# EAGLE design Proto_shield_REV3-chris (EAGLE 7.1.0)
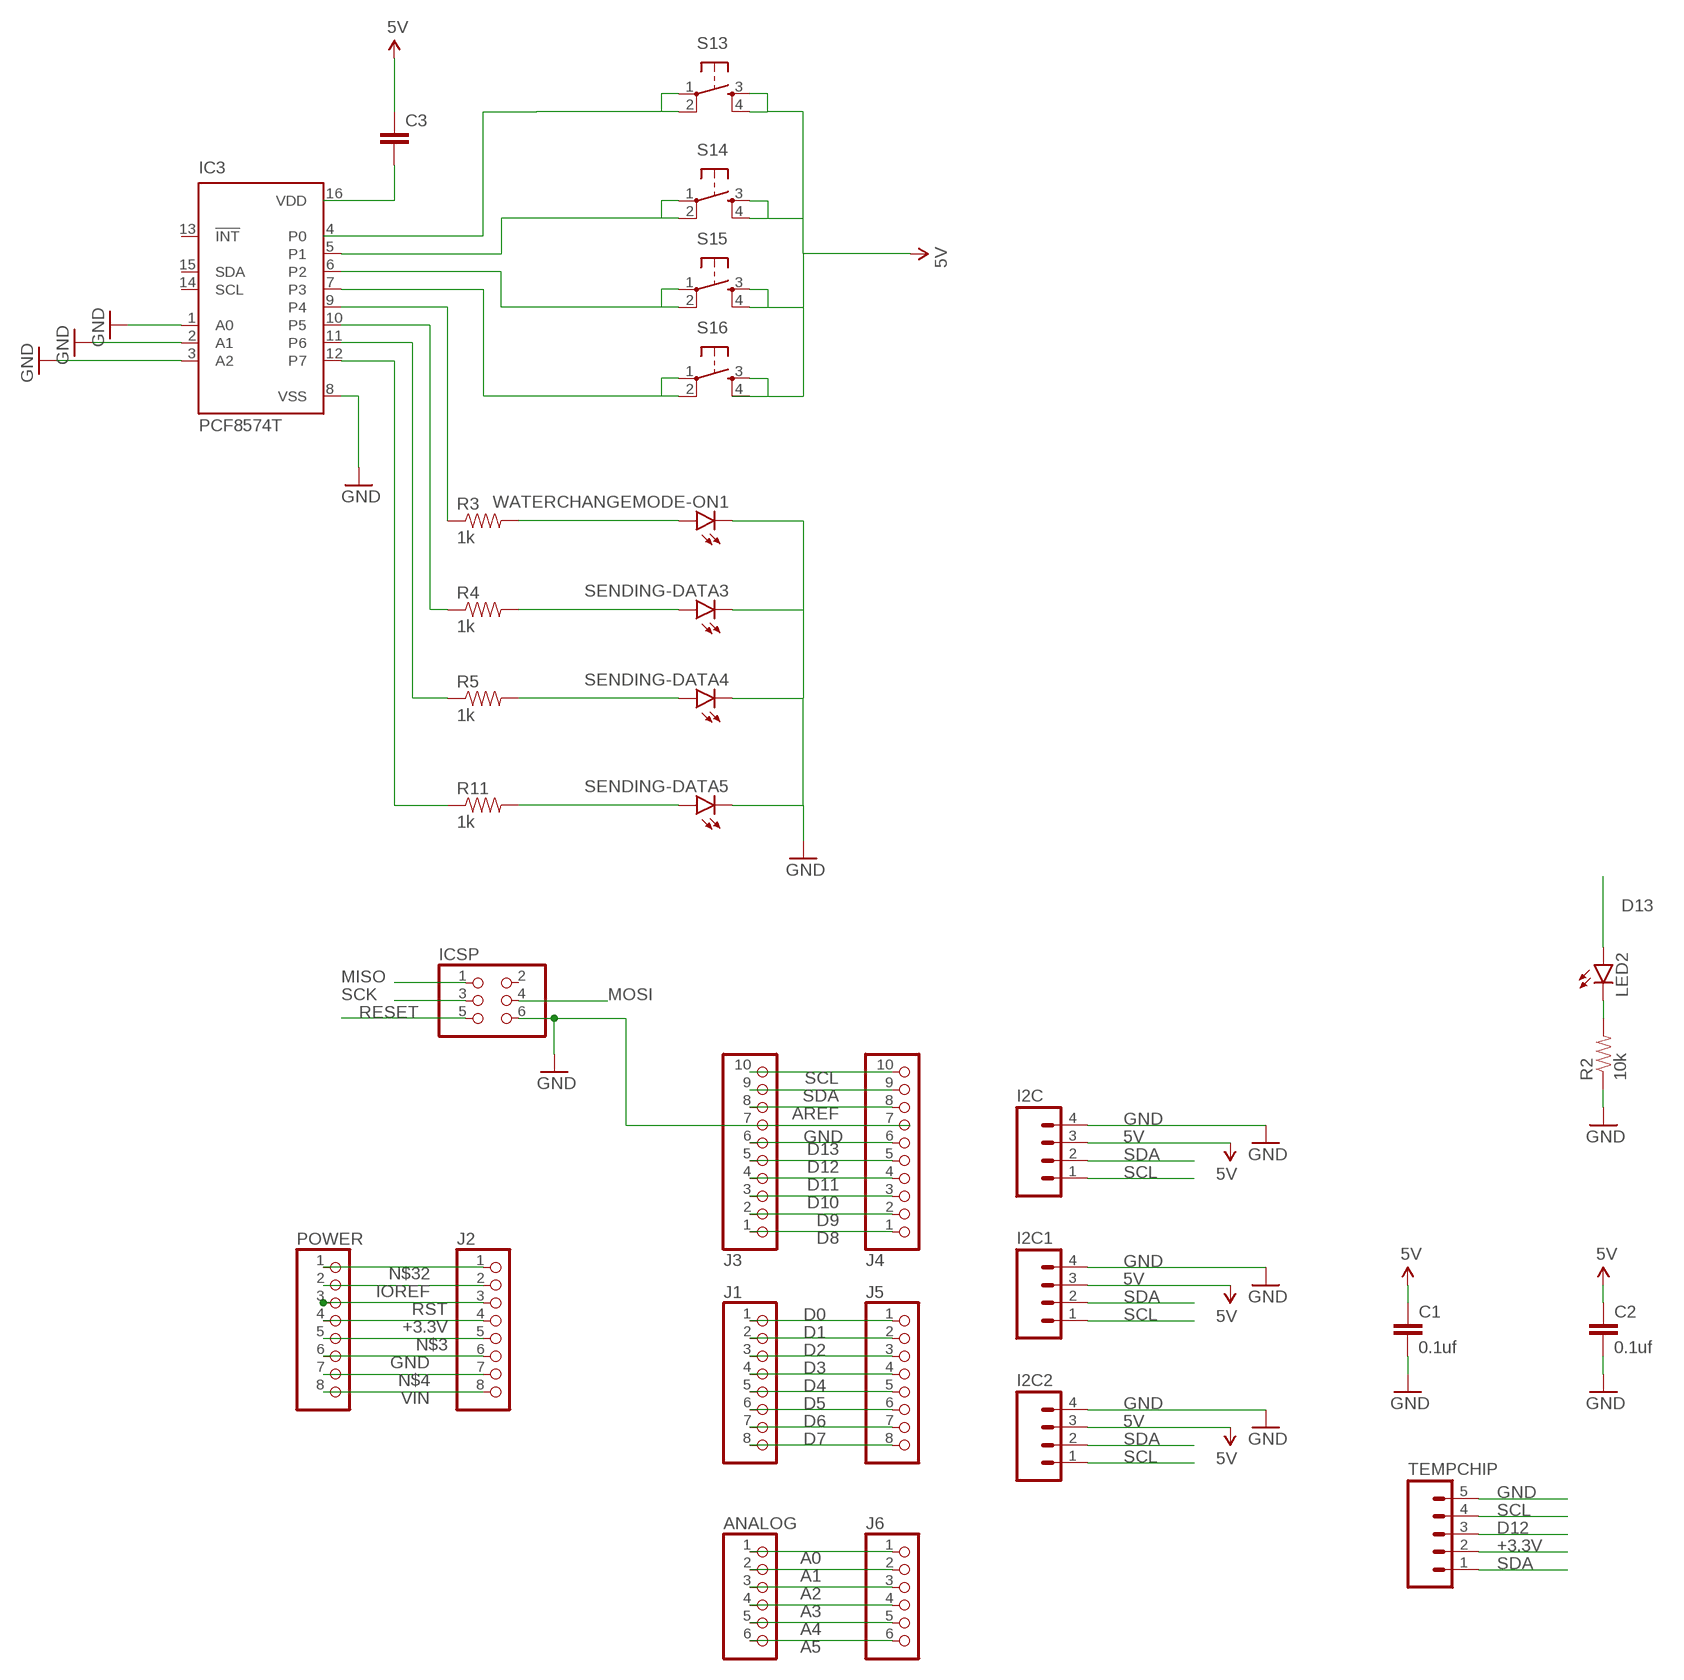
[diagram p0: schematic, sheet 1]

## Parts
ANALOG  PINHD-1X6  [1X06]
C1  0.1uf  CAPPTH2  [CAP-PTH-SMALL2]
C2  0.1uf  CAPPTH2  [CAP-PTH-SMALL2]
C3  CAPPTH2  [CAP-PTH-SMALL2]
I2C  M04PTH  [1X04]
I2C1  M04PTH  [1X04]
I2C2  M04PTH  [1X04]
IC3  PCF8574T  [SO16W]
ICSP  PINHD-2X3  [2X03]
J1  PINHD-1X8TH  [1X08-TH]
J2  PINHD-1X8TH  [1X08-TH]
J3  PINHD-1X10TH  [1X10-TH]
J4  PINHD-1X10TH  [1X10-TH]
J5  PINHD-1X8TH  [1X08-TH]
J6  PINHD-1X6  [1X06]
LED2  LED5MM  [LED5MM]
POWER  PINHD-1X8TH  [1X08-TH]
R2  10k  RESISTORAXIAL-0.3  [AXIAL-0.3]
R3  1k  RESISTORAXIAL-0.3  [AXIAL-0.3]
R4  1k  RESISTORAXIAL-0.3  [AXIAL-0.3]
R5  1k  RESISTORAXIAL-0.3  [AXIAL-0.3]
R11  1k  RESISTORAXIAL-0.3  [AXIAL-0.3]
S13  TAC_SWITCHPTH  [TACTILE-PTH]
S14  TAC_SWITCHPTH  [TACTILE-PTH]
S15  TAC_SWITCHPTH  [TACTILE-PTH]
S16  TAC_SWITCHPTH  [TACTILE-PTH]
SENDING-DATA3  LED3MM  [LED3MM]
SENDING-DATA4  LED3MM  [LED3MM]
SENDING-DATA5  LED3MM  [LED3MM]
TEMPCHIP  M051.27MM  [1X05-1.27MM]
WATERCHANGEMODE-ON1  LED3MM  [LED3MM]

## Nets
5V: C1.1 C2.1 C3.1 I2C1.3 I2C2.3 I2C.3 S13.3 S13.4 S14.3 S14.4 S15.3 S15.4 S16.3 S16.4
+3.3V: J2.4 POWER.4 TEMPCHIP.2
A0: ANALOG.1 J6.1
A1: ANALOG.2 J6.2
A2: ANALOG.3 J6.3
A3: ANALOG.4 J6.4
A4: ANALOG.5 J6.5
A5: ANALOG.6 J6.6
AREF: J3.8 J4.8
D0: J1.1 J5.1
D1: J1.2 J5.2
D2: J1.3 J5.3
D3: J1.4 J5.4
D4: J1.5 J5.5
D5: J1.6 J5.6
D6: J1.7 J5.7
D7: J1.8 J5.8
D8: J3.1 J4.1
D9: J3.2 J4.2
D10: J3.3 J4.3
D11: J3.4 J4.4
D12: J3.5 J4.5 TEMPCHIP.3
D13: J3.6 J4.6 LED2.A
GND: C1.2 C2.2 I2C1.4 I2C2.4 I2C.4 IC3.1(A0) IC3.2(A1) IC3.3(A2) IC3.8(VSS) ICSP.6 J2.6 POWER.6 R2.P$1 SENDING-DATA3.K(C) SENDING-DATA4.K(C) SENDING-DATA5.K(C) TEMPCHIP.5 WATERCHANGEMODE-ON1.K(C)
IOREF: J2.2 POWER.2
MISO: ICSP.1
MOSI: ICSP.4
N$1: LED2.K(C) R2.P$2
N$3: J2.5 POWER.5
N$4: J2.7 POWER.7
N$5: R5.P$2 SENDING-DATA4.A
N$6: R11.P$2 SENDING-DATA5.A
N$7: R3.P$2 WATERCHANGEMODE-ON1.A
N$21: IC3.11(P6) R5.P$1
N$22: IC3.12(P7) R11.P$1
N$25: IC3.9(P4) R3.P$1
N$27: IC3.10(P5) R4.P$1
N$30: IC3.7(P3) S16.1 S16.2
N$31: IC3.5(P1) S14.1 S14.2
N$32: J2.1 POWER.1
N$35: S13.1 S13.2
N$36: C3.2
N$37: IC3.6(P2) S15.1 S15.2
N$44: R4.P$2 SENDING-DATA3.A
RESET: ICSP.5
RST: J2.3 POWER.3
SCK: ICSP.3
SCL: I2C1.1 I2C2.1 I2C.1 J3.10 J4.10 TEMPCHIP.4
SDA: I2C1.2 I2C2.2 I2C.2 J3.9 J4.9 TEMPCHIP.1
VIN: J2.8 POWER.8
Unconnected: IC3.4(P0) IC3.13(!INT) IC3.14(SCL) IC3.15(SDA) ICSP.2 J3.7 J4.7

## Power pins joined to a net without a drawn wire
VDD: IC3.16(VDD)

## Library data of the parts
ANALOG J6 = pinhead:PINHD-1X6: PIN HEADER
C1-C3 = SparkFun-Capacitors:CAP: Capacitor Standard 0603 ceramic capacitor, and 0.1" leaded capacitor.
I2C I2C1 I2C2 = SparkFun-Connectors:M04: Header 4 Standard 4-pin 0.1" header. Use with straight break away headers (SKU : PRT-00116), right angle break away headers (PRT-00553), swiss pins (PRT-00743), machine pins (PRT-00117), and female headers (PRT-00115). Molex polarized connector foot print use with SKU : PRT-08231 with associated crimp pins and housings. 1MM SMD Version SKU: PRT-10208
IC3 = micro-philips:PCF8574: I2C-Bus Remote 8-bit I/O expander http://www.semiconductors.philips.com/acrobat_download/datasheets/PCF8574_4.pdf
ICSP = SmartPrj:PINHD-2X3: PIN HEADER
J1 J2 J5 POWER = SmartPrj:PINHD-1X8: PIN HEADER
J3 J4 = SmartPrj:PINHD-1X10: PIN HEADER
LED2 SENDING-DATA3-SENDING-DATA5 WATERCHANGEMODE-ON1 = SparkFun-LED:LED: LEDs Standard schematic elements and footprints for 5mm, 3mm, 1206, and 0603 sized LEDs. 5mm - Spark Fun Electronics SKU : COM-00529 (and others)
R2-R5 R11 = SparkFun-Resistors:RESISTOR: Resistor Basic schematic elements and footprints for 0603, 1206, and PTH resistors.
S13-S16 = SparkFun-Electromechanical:TAC_SWITCH: Momentary Switch Button commonly used for reset or general input. Spark Fun Electronics SKU : COM-00097 SMT- SWCH-08247
TEMPCHIP = SparkFun-Connectors:M05: Header 5 Standard 5-pin 0.1" header. Use with straight break away headers (SKU : PRT-00116), right angle break away headers (PRT-00553), swiss pins (PRT-00743), machine pins (PRT-00117), and female headers (PRT-00115). Molex polarized connector foot print use with SKU : PRT-08230 with associated crimp pins and housings.

## Board
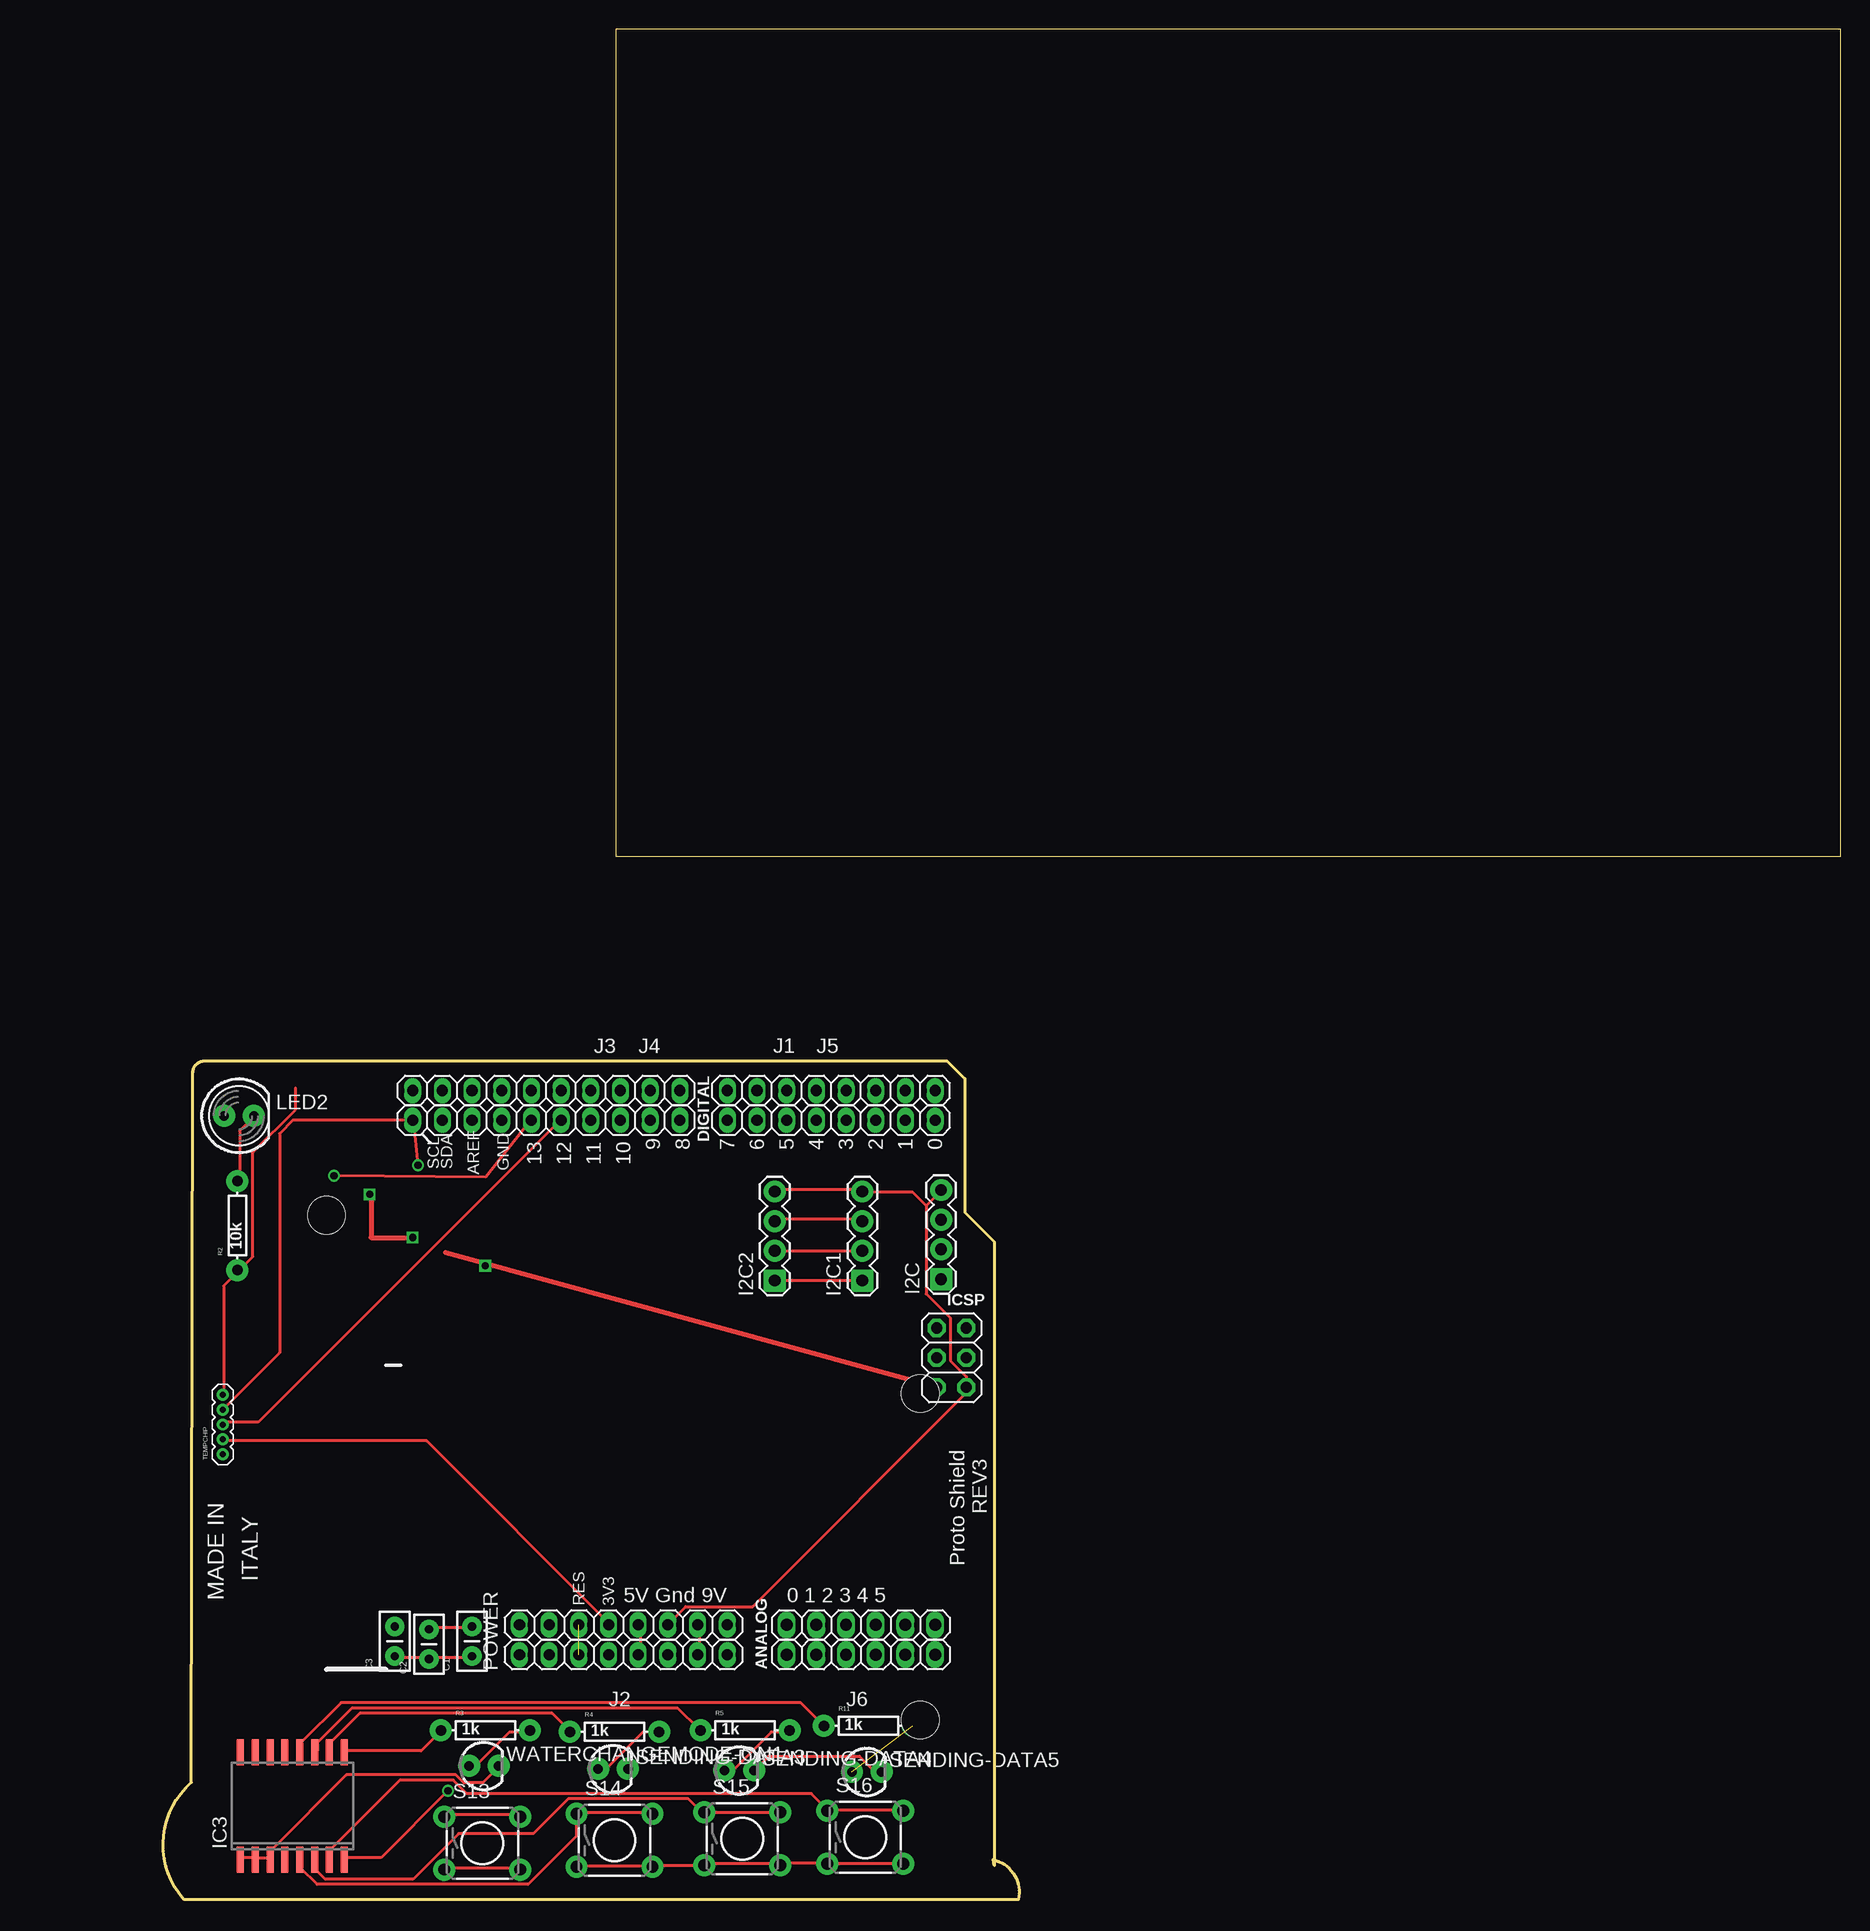
[diagram p1: board, top side]
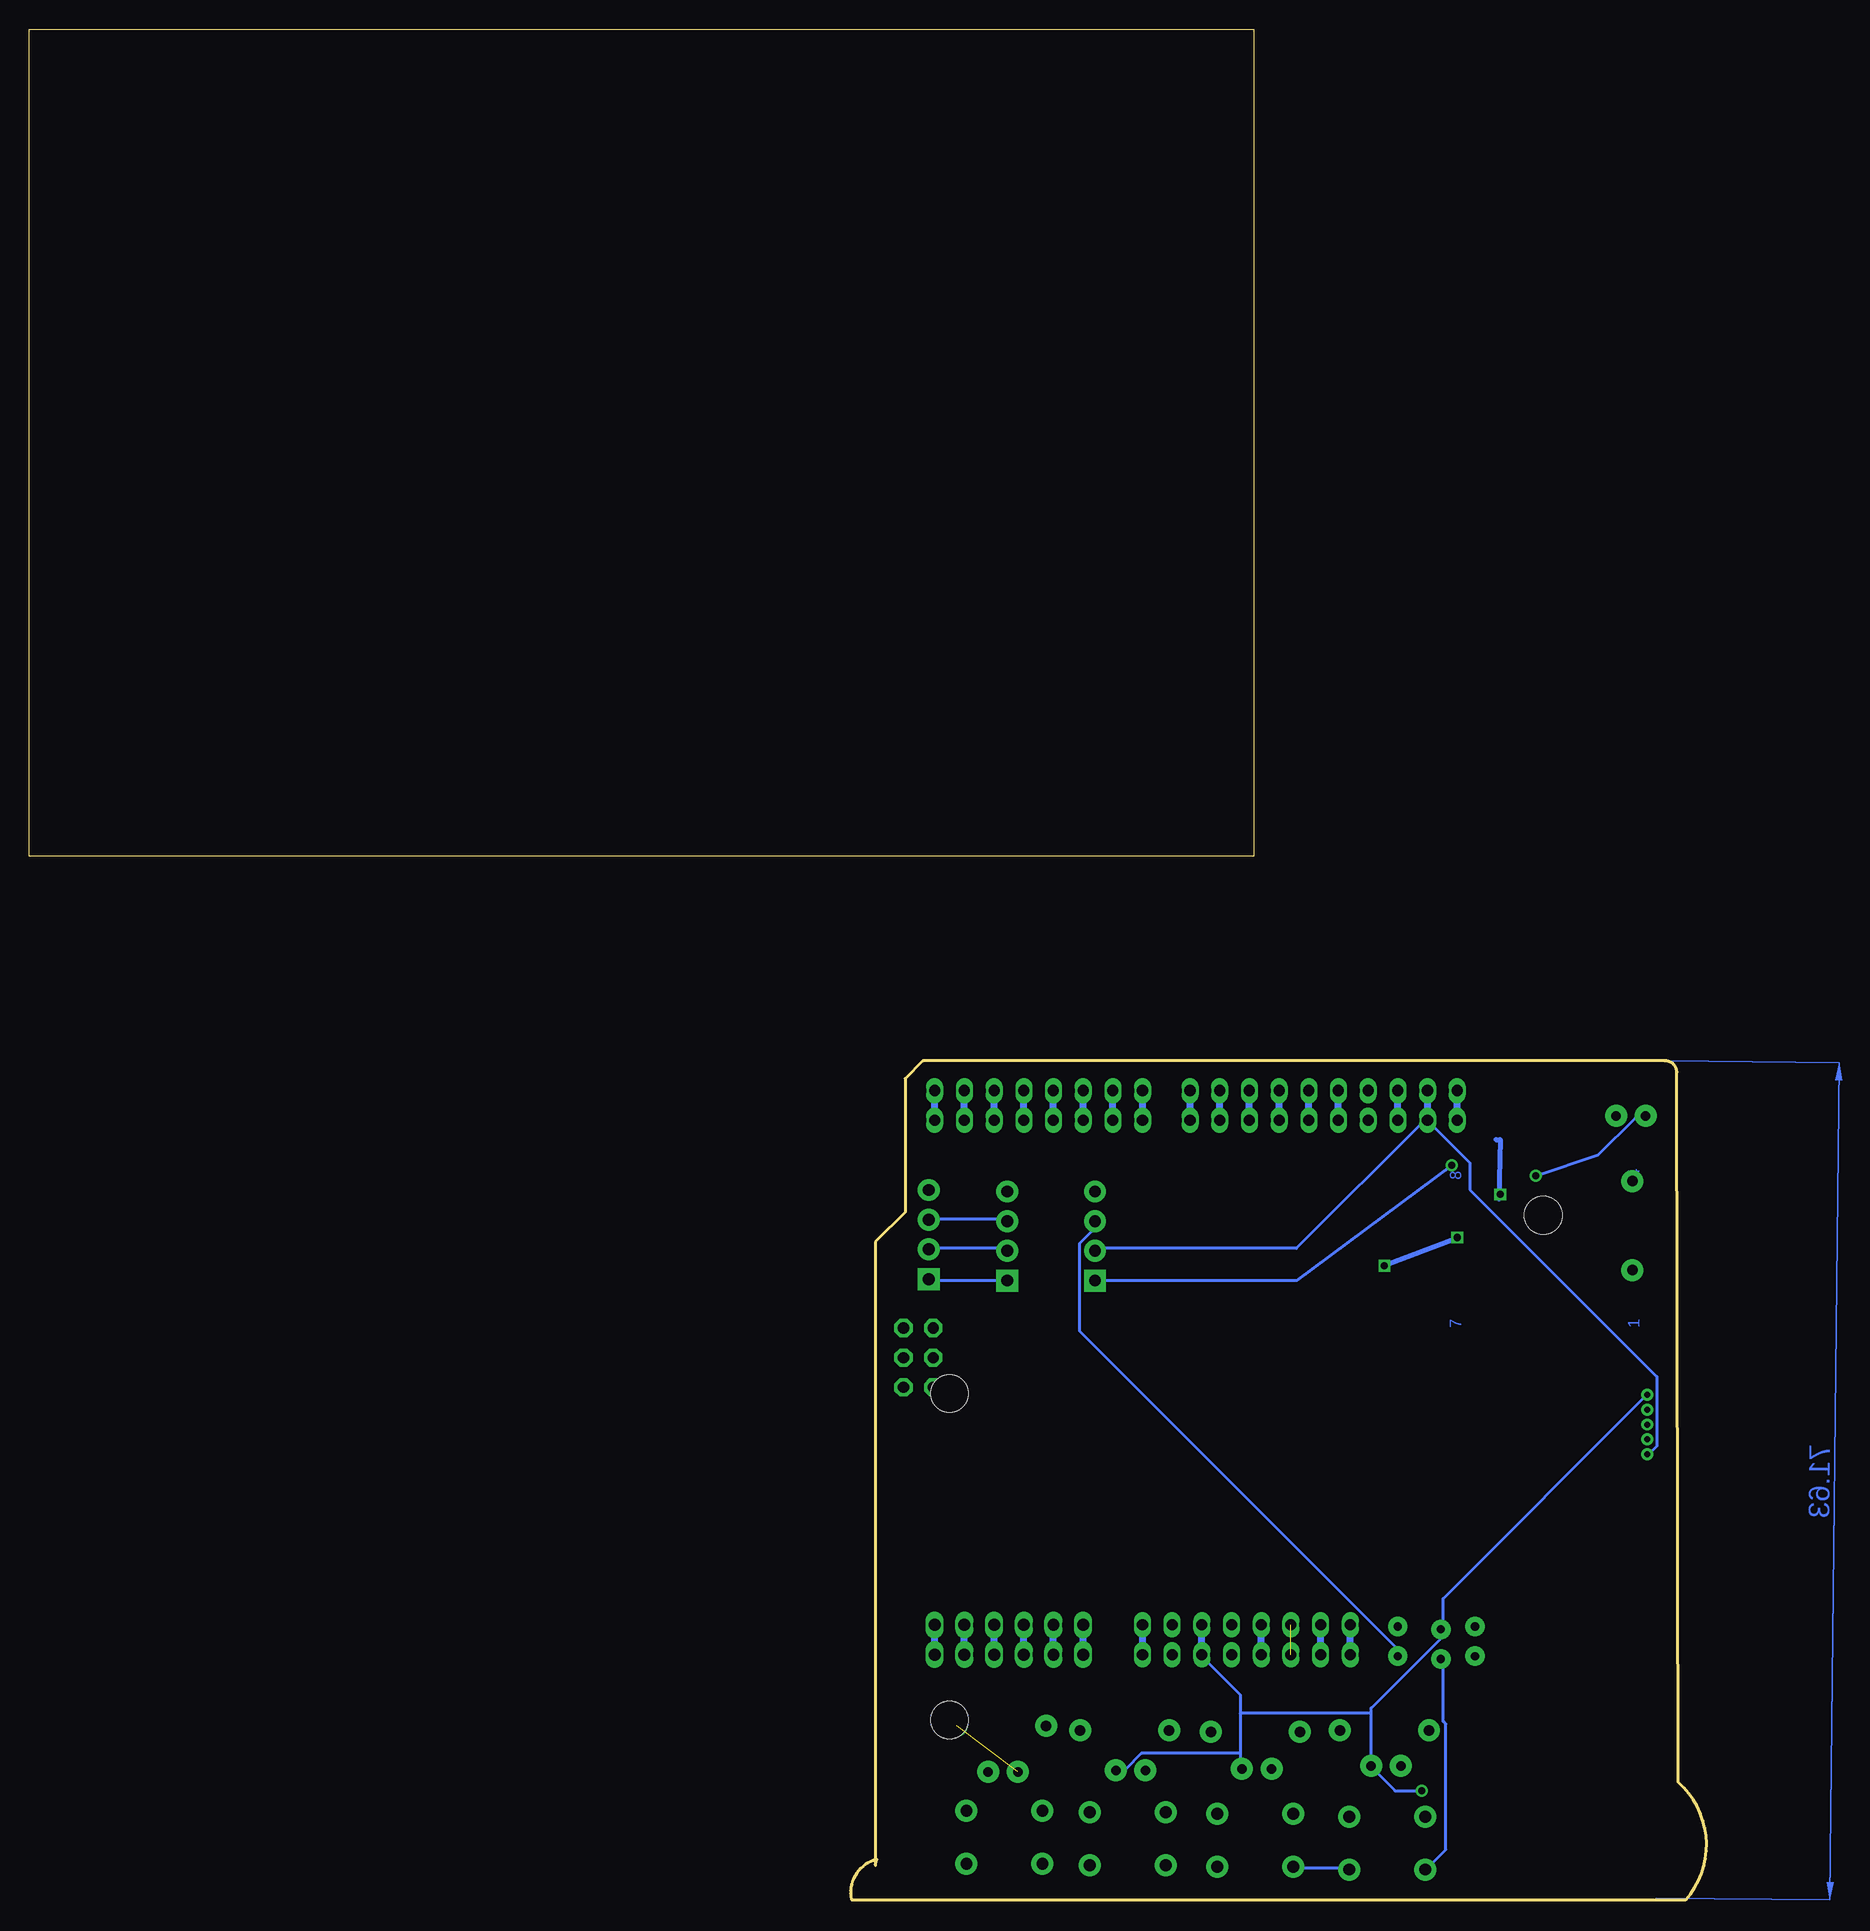
[diagram p2: board, bottom side, seen from below]

Size 143.51 x 160.02 mm. Coordinates in mm from the lower left corner, seen from the top.
Outline: 67.06,71.75 68.58,70.23 68.58,58.8 71.12,56.26 71.12,2.92 70.99,3.41 arc-90 73.17,0 1.76,0 arc-90 2.41,10.02 2.54,70.75 arc-90 3.54,71.75 67.06,71.75
Copper layers (1*16): Top 0.035mm / dielectric 1.5mm / Bottom 0.035mm
Design rules "default": minimum track width 10mil, minimum drill 24mil, track to track 8mil, track to pad 8mil, pad to pad 8mil, via to via 8mil, smd to smd 8mil, copper to edge 40mil, drill to drill 8mil, minimum pad ring 10mil, minimum via ring 8mil, stop-mask expansion 2mil, vias tented up to drill 0mil, thermal gap 10mil
Holes 3.2 mm at 13.97,58.55 64.77,15.37 64.77,43.31

### Footprints (pad centres in the part's own frame; a part is rotated, then mirrored left to right if it is on the bottom)
1X06 = drill 1.016 long: 1 -6.35,0; 2 -3.81,0; 3 -1.27,0; 4 1.27,0; 5 3.81,0; 6 6.35,0
CAP-PTH-SMALL2 = drill 0.7 pad 1.651: 1 0,0; 2 2.54,0
1X04 = drill 1.016 pad 1.88 square: 1 0,0 | drill 1.016 pad 1.88: 2 2.54,0; 3 5.08,0; 4 7.62,0
SO16W = smd 0.6 x 2.2: 1 -4.445,-4.6; 2 -3.175,-4.6; 3 -1.905,-4.6; 4 -0.635,-4.6; 5 0.635,-4.6; 6 1.905,-4.6; 7 3.175,-4.6; 8 4.445,-4.6; 9 4.445,4.6; 10 3.175,4.6; 11 1.905,4.6; 12 0.635,4.6; 13 -0.635,4.6; 14 -1.905,4.6; 15 -3.175,4.6; 16 -4.445,4.6
2X03 = drill 0.95 pad 1.55 octagon: 1 -2.54,-1.27; 2 -2.54,1.27; 3 0,-1.27; 4 0,1.27; 5 2.54,-1.27; 6 2.54,1.27
1X08-TH = drill 0.95 pad 1.422 long: 1 -8.89,0; 2 -6.35,0; 3 -3.81,0; 4 -1.27,0; 5 1.27,0; 6 3.81,0; 7 6.35,0; 8 8.89,0
1X10-TH = drill 0.95 pad 1.422 long: 1 -11.43,0; 2 -8.89,0; 3 -6.35,0; 4 -3.81,0; 5 -1.27,0; 6 1.27,0; 7 3.81,0; 8 6.35,0; 9 8.89,0; 10 11.43,0
LED5MM = drill 0.813 pad 1.88: A -1.27,0; K 1.27,0
AXIAL-0.3 = drill 0.9 pad 1.88: P$1 -3.81,0; P$2 3.81,0
TACTILE-PTH = drill 1.016 pad 1.88: 1 -3.251,2.261; 2 3.251,2.261; 3 -3.251,-2.261; 4 3.251,-2.261
LED3MM = drill 0.813 pad 1.88: A -1.27,0; K 1.27,0
1X05-1.27MM = drill 0.508 pad 1: 1 0,0; 2 1.27,0; 3 2.54,0; 4 3.81,0; 5 5.08,0

### Placement (x,y rotation side)
ANALOG  59.69,20.96 0 top
C1  26.42,20.83 90 top
C2  22.73,20.57 90 top
C3  19.81,20.83 90 top
I2C  66.55,53.09 90 top
I2C1  59.82,52.96 90 top
I2C2  52.32,52.96 90 top
IC3  11.05,8 0 top
ICSP  67.44,46.35 270 top
J1  57.15,69.22 180 top
J2  39.37,20.96 0 top
J3  32.77,69.22 180 top
J4  32.77,66.67 180 top
J5  57.15,66.67 180 top
J6  59.69,23.5 0 top
LED2  6.48,67.06 0 top
POWER  39.37,23.5 0 top
R2  6.35,57.66 90 top
R3  27.56,14.48 0 top
R4  38.61,14.35 0 top
R5  49.78,14.48 0 top
R11  60.33,14.86 0 top
S13  27.31,4.83 0 top
S14  38.61,5.08 0 top
S15  49.53,5.21 0 top
S16  60.07,5.33 0 top
SENDING-DATA3  38.48,11.18 0 top
SENDING-DATA4  49.28,11.05 0 top
SENDING-DATA5  60.2,10.92 0 top
TEMPCHIP  5.08,38.1 90 top
WATERCHANGEMODE-ON1  27.43,11.43 0 top

### Tracks (layer width: path | path; a pad name or v marks a point on that pad's centre or on a via)
5V
  Top 0.254: I2C2.3 52.48,58.22 59.79,58.22 I2C1.3 | 56.82,3.12 52.93,3.12 S15.4 52.71,3.12 46.3,3.12 S15.3 46.08,2.9 41.96,2.9 S14.4 41.73,2.9 35.56,2.9 S14.3 | 56.82,3.12 63.22,3.12 S16.4 | 56.82,3.12 S16.3 | C3.1 20.02,20.73 22.53,20.73 C2.1 22.76,20.73 26.42,20.73 C1.1 | S13.3 24.13,2.67 30.53,2.67 S13.4
  Bottom 0.254: I2C.3 66.42,58.22 60.02,58.22 I2C1.3 | S14.3 35.33,2.67 30.76,2.67 S13.4 | C2.1 22.53,20.5 22.53,15.24 22.3,15.01 22.3,4.27 23.9,2.67 S13.3 | C1.1 26.42,21.41 53.62,48.62 53.62,56.16 52.48,57.3 52.48,57.99 I2C2.3
+3.3V
  Top 0.254: TEMPCHIP.2 5.16,39.24 22.53,39.24 38.08,23.7 POWER.4
  Bottom 0.61: J2.4 POWER.4
A0
  Bottom 0.61: ANALOG.1 J6.1
A1
  Bottom 0.61: ANALOG.2 J6.2
A2
  Bottom 0.61: ANALOG.3 J6.3
A3
  Bottom 0.61: ANALOG.4 J6.4
A4
  Bottom 0.61: ANALOG.5 J6.5
A5
  Bottom 0.61: ANALOG.6 J6.6
AREF
  Bottom 0.61: J4.8 J3.8
D0
  Bottom 0.61: J5.1 J1.1
D1
  Bottom 0.61: J5.2 J1.2
D2
  Bottom 0.61: J5.3 J1.3
D3
  Bottom 0.61: J5.4 J1.4
D4
  Bottom 0.61: J5.5 J1.5
D5
  Bottom 0.61: J5.6 J1.6
D6
  Bottom 0.61: J5.7 J1.7
D7
  Bottom 0.61: J5.8 J1.8
D8
  Bottom 0.61: J4.1 J3.1
D9
  Bottom 0.61: J4.2 J3.2
D10
  Bottom 0.61: J4.3 J3.3
D11
  Bottom 0.61: J4.4 J3.4
D12
  Top 0.254: TEMPCHIP.3 5.16,40.84 8.13,40.84 33.96,66.67 J4.5
  Bottom 0.61: J4.5 J3.5
D13  (via drill 0.61)
  Top 0.254: v14.61,61.92 27.58,61.8 31.45,66.67 J4.6
  Bottom 0.254: v14.61,61.92 9.27,63.7 6.07,66.9 5.39,66.9 LED2.A
  Bottom 0.61: J4.6 J3.6
GND  (via drill 0.61)
  Top 0.254: TEMPCHIP.5 5.16,43.36 5.16,52.5 6.3,53.65 R2.P$1 6.53,53.87 7.67,55.02 7.67,63.93 11.33,67.59 11.33,69.42 | I2C2.4 52.48,60.73 59.79,60.73 I2C1.4 60.02,60.5 64.14,60.5 65.28,59.36 | 65.28,59.36 65.28,51.82 67.34,49.76 67.34,46.1 68.71,44.73 ICSP.6 68.71,43.36 50.42,25.07 44.7,25.07 43.33,23.7 POWER.6 | 65.28,59.36 66.42,60.5 I2C.4 | SENDING-DATA5.K 61.39,11.12 60.71,11.12 59.56,12.27 51.79,12.27 50.65,11.12 SENDING-DATA4.K | C2.2 22.76,23.24 26.42,23.24 C1.2 | IC3.1 6.76,3.58 7.67,3.58 IC3.2 7.9,3.58 9.04,3.58 IC3.3 9.27,3.58 9.27,4.27 15.67,10.67 25.04,10.67 25.73,9.98 27.33,9.98 28.7,11.35 WATERCHANGEMODE-ON1.K | v24.36,9.3 18.64,3.58 15.67,3.58 IC3.8
  Bottom 0.254: 39.9,15.93 39.9,17.53 43.1,20.73 J2.6 | 39.9,15.93 39.9,12.5 | 39.9,12.5 39.9,11.35 SENDING-DATA3.K | 39.9,12.5 48.36,12.5 49.73,11.12 50.42,11.12 SENDING-DATA4.K | v24.36,9.3 26.65,9.3 28.7,11.35 WATERCHANGEMODE-ON1.K 28.7,15.93 | 28.7,15.93 28.7,16.38 22.76,22.33 22.76,23.01 C2.2 22.53,23.24 22.53,25.76 5.16,43.13 TEMPCHIP.5 | 28.7,15.93 39.9,15.93
  Bottom 0.61: J2.6 POWER.6
IOREF
  Bottom 0.61: J2.2 POWER.2
N$1
  Top 0.254: R2.P$2 6.53,61.65 6.53,65.76 7.67,66.9 LED2.K
N$3
  Top 0.254: J2.5 40.82,20.96 40.82,23.47 POWER.5
N$4
  Top 0.254: J2.7 45.85,20.96 45.85,23.47 POWER.7
N$5
  Top 0.254: SENDING-DATA4.A 48.13,11.12 48.82,11.12 52.02,14.33 53.39,14.33 R5.P$2
N$6  (1 unrouted)
N$7
  Top 0.254: WATERCHANGEMODE-ON1.A 26.19,11.58 26.87,11.58 29.62,14.33 31.22,14.33 R3.P$2
N$8
  Bottom 0.406: 18.03,65.02 17.65,65.02 17.78,59.94
N$9  (via drill 0.6)
  Top 0.406: v17.65,60.33 17.78,60.33 17.78,56.64 v21.34,56.64 21.46,56.64 21.46,56.52
N$10
  Top 0.406: 24.13,55.37 66.29,43.81
N$11  (via drill 0.6)
  Bottom 0.406: 21.46,56.52 v27.56,54.23
N$21
  Top 0.254: IC3.11 13.16,12.72 13.16,13.41 16.13,16.38 44.02,16.38 45.85,14.55 R5.P$1
N$22
  Top 0.254: R11.P$1 54.53,16.84 15.22,16.84 11.79,13.41 11.79,12.72 IC3.12
N$25
  Top 0.254: IC3.9 15.67,12.72 22.07,12.72 23.67,14.33 R3.P$1
N$27
  Top 0.254: IC3.10 14.3,12.72 14.3,13.41 16.82,15.93 33.27,15.93 34.65,14.55 R4.P$1
N$30
  Top 0.254: 56.82,7.7 55.45,9.07 25.96,9.07 24.82,10.21 20.24,10.21 14.3,4.27 14.3,3.58 IC3.7 | 56.82,7.7 63.22,7.7 S16.2 | 56.82,7.7 S16.1
N$31
  Top 0.254: IC3.5 11.79,3.35 11.79,2.67 13.16,1.29 31.22,1.29 35.33,5.41 35.33,7.24 S14.1 35.56,7.47 41.73,7.47 S14.2
N$32
  Bottom 0.61: J2.1 POWER.1
N$35
  Top 0.254: S13.1 24.13,7.24 30.53,7.24 S13.2
N$37
  Top 0.254: IC3.6 13.16,3.35 13.16,2.44 13.84,1.75 21.39,1.75 25.27,5.64 31.67,5.64 34.65,8.61 44.93,8.61 46.08,7.47 S15.1 S15.2
N$44
  Top 0.254: SENDING-DATA3.A 37.39,11.35 38.08,11.35 41.05,14.33 42.42,14.33 R4.P$2
RST  (1 unrouted)
SCL  (via drill 0.61)
  Top 0.254: I2C1.1 I2C2.1 | TEMPCHIP.4 9.96,46.79 9.96,65.53 11.1,66.67 J4.10 21.39,66.67 v21.79,62.84
  Bottom 0.254: I2C1.1 66.42,52.96 I2C.1 | I2C2.1 35.1,52.96 v21.79,62.84
  Bottom 0.61: J4.10 J3.10
SDA
  Top 0.254: I2C2.2 52.48,55.47 59.79,55.47 I2C1.2
  Bottom 0.254: I2C.2 66.42,55.7 60.02,55.7 I2C1.2 | TEMPCHIP.1 4.93,38.1 4.24,38.79 4.24,44.73 20.24,60.73 20.24,63.02 23.9,66.67 J4.9 24.13,66.67 35.1,55.7 52.25,55.7 I2C2.2
  Bottom 0.61: J4.9 J3.9
VIN
  Bottom 0.61: J2.8 POWER.8
(copper drawn outside any net)
  shapes: Bottom area x1

### Text on the board
Bottom: 14 | 8 | 1 | 7
tPlace: 9 | 8 | 7 | 6 | 5 | 4 | 3 | 2 | 1 | 0 | 13 | 12 | 11 | 10 | REV3 | Proto Shield
tNames: DIGITAL | AREF | SCL | SDA | GND | ITALY | MADE IN | RES | 3V3 | 5V Gnd 9V | 0 1 2 3 4 5
bStop: DIGITAL | SDA | AREF | SCL | GND | 13 | 12 | 11 | 10 | 9 | 8 | 7 | 6 | 5 | 4 | 3 | 2 | 1 | 0 | 14 | 8 | 1 | 7 | 1 | 2 | 3 | 4 | 5 | 6 | IOREF | RST | 3.3V | 5V | GND | GND | VIN | ANALOG | 0 | 1 | 2 | 3 | 4 | 5